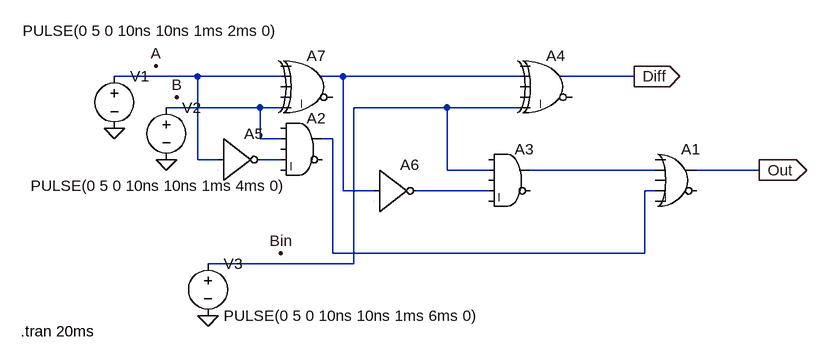
[diagram p0: schematic full_subtractor.asc]
full_subtractor.asc, the LTspice schematic file:
Version 4
SHEET 1 880 680
WIRE -288 -272 -416 -272
WIRE -160 -272 -288 -272
WIRE -64 -272 -96 -272
WIRE 208 -272 -64 -272
WIRE 384 -272 272 -272
WIRE -192 -224 -336 -224
WIRE -160 -224 -192 -224
WIRE 96 -224 -48 -224
WIRE 208 -224 96 -224
WIRE -192 -176 -192 -224
WIRE -160 -176 -192 -176
WIRE -80 -176 -96 -176
WIRE -288 -144 -288 -272
WIRE -256 -144 -288 -144
WIRE -160 -144 -192 -144
WIRE 96 -128 96 -224
WIRE 160 -128 96 -128
WIRE 416 -128 224 -128
WIRE 576 -128 480 -128
WIRE -64 -96 -64 -272
WIRE -16 -96 -64 -96
WIRE 160 -96 48 -96
WIRE 416 -96 400 -96
WIRE -80 0 -80 -176
WIRE 400 0 400 -96
WIRE 400 0 -80 0
WIRE -48 16 -48 -224
WIRE -48 16 -272 16
FLAG -416 -192 0
FLAG -336 -144 0
FLAG -272 96 0
FLAG 384 -272 Diff
IOPIN 384 -272 Out
FLAG 576 -128 Out
IOPIN 576 -128 Out
FLAG -160 0 Bin
FLAG -352 -288 A
FLAG -320 -240 B
SYMBOL Digital\\or 448 -176 R0
SYMATTR InstName A1
SYMBOL Digital\\and -128 -224 R0
SYMATTR InstName A2
SYMBOL Digital\\and 192 -176 R0
SYMATTR InstName A3
SYMBOL Digital\\xor 256 -320 R0
SYMATTR InstName A4
SYMBOL Digital\\xor -112 -320 R0
SYMATTR InstName A7
SYMBOL voltage -416 -288 R0
WINDOW 3 -141 -54 Left 2
WINDOW 123 0 0 Left 0
WINDOW 39 0 0 Left 0
SYMATTR Value PULSE(0 5 0 10ns 10ns 1ms 2ms 0)
SYMATTR InstName V1
SYMBOL voltage -336 -240 R0
WINDOW 3 -209 136 Left 2
WINDOW 123 0 0 Left 0
WINDOW 39 0 0 Left 0
SYMATTR Value PULSE(0 5 0 10ns 10ns 1ms 4ms 0)
SYMATTR InstName V2
SYMBOL voltage -272 0 R0
WINDOW 123 0 0 Left 0
WINDOW 39 0 0 Left 0
SYMATTR InstName V3
SYMATTR Value PULSE(0 5 0 10ns 10ns 1ms 6ms 0)
SYMBOL Digital\\inv -256 -208 R0
SYMATTR InstName A5
SYMBOL Digital\\inv -16 -160 R0
SYMATTR InstName A6
TEXT -560 120 Left 2 !.tran 20ms

The netlist it stands for:
* full_subtractor.asc
A1 0 N007 0 N005 0 0 Out 0 OR
A2 0 N003 0 N006 0 0 N005 0 AND
A3 0 N004 0 N008 0 0 N007 0 AND
A4 0 N002 0 0 N004 0 Diff 0 XOR
A7 0 N001 0 0 N003 0 N002 0 XOR
V1 N001 0 PULSE(0 5 0 10ns 10ns 1ms 2ms 0)
V2 N003 0 PULSE(0 5 0 10ns 10ns 1ms 4ms 0)
V3 N004 0 PULSE(0 5 0 10ns 10ns 1ms 6ms 0)
A5 N001 0 0 0 0 N006 0 0 BUF
A6 N002 0 0 0 0 N008 0 0 BUF
.tran 20ms
.backanno
.end